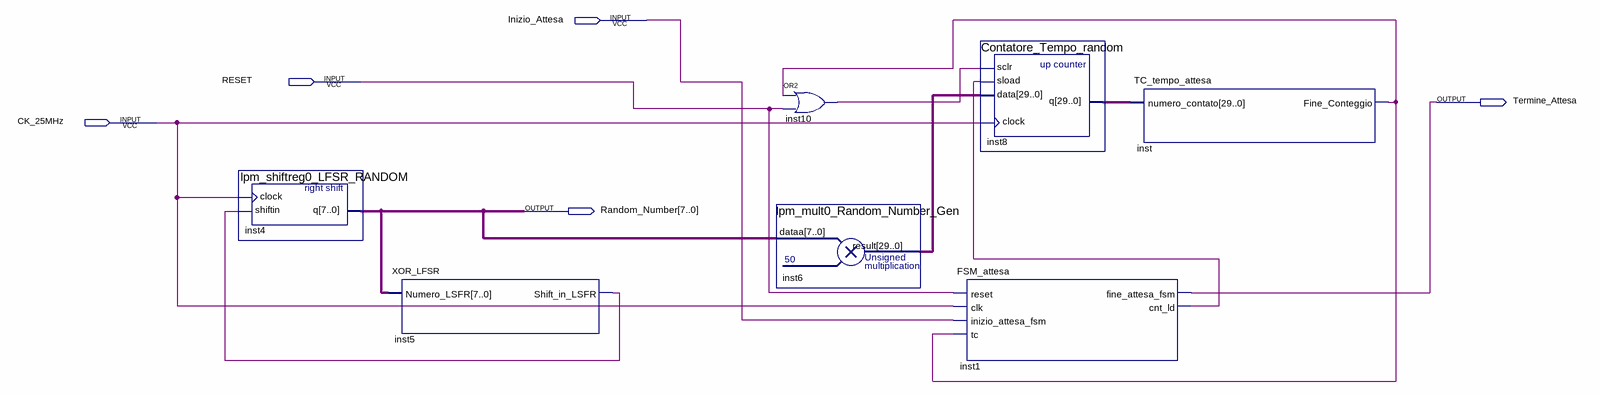
[diagram p0: schematic sheet]
// Quartus schematic Random_Time_Generator.bdf as structural Verilog: 7 symbols, 5 pins
module Random_Time_Generator (
  input  Inizio_Attesa,
  input  RESET,
  input  CK_25MHz,
  output Termine_Attesa,
  output [7:0] Random_Number
);

  wire inst1_cnt_ld, inst5_shift_in_lsfr, inst10_out, inst_fine_conteggio;
  wire [29:0] inst6_result, inst8_q;

  lpm_shiftreg0_LFSR_RANDOM inst4 (.clock(CK_25MHz), .shiftin(inst5_shift_in_lsfr), .q(Random_Number));
  XOR_LFSR inst5 (.Numero_LSFR(Random_Number), .Shift_in_LSFR(inst5_shift_in_lsfr));
  or inst10 (inst10_out, inst_fine_conteggio, RESET);
  lpm_mult0_Random_Number_Gen inst6 (.dataa(Random_Number), .result(inst6_result));
  Contatore_Tempo_random inst8 (
    .sclr(inst10_out), .sload(inst1_cnt_ld), .data(inst6_result), .clock(CK_25MHz), .q(inst8_q));
  FSM_attesa inst1 (
    .reset(RESET), .clk(CK_25MHz), .inizio_attesa_fsm(Inizio_Attesa), .tc(inst_fine_conteggio),
    .fine_attesa_fsm(Termine_Attesa), .cnt_ld(inst1_cnt_ld));
  TC_tempo_attesa inst (.numero_contato(inst8_q), .Fine_Conteggio(inst_fine_conteggio));
endmodule
